# Altium schematic sheet Filters.SchDoc
size A4; SheetNumber: 4; SheetTotal: 4
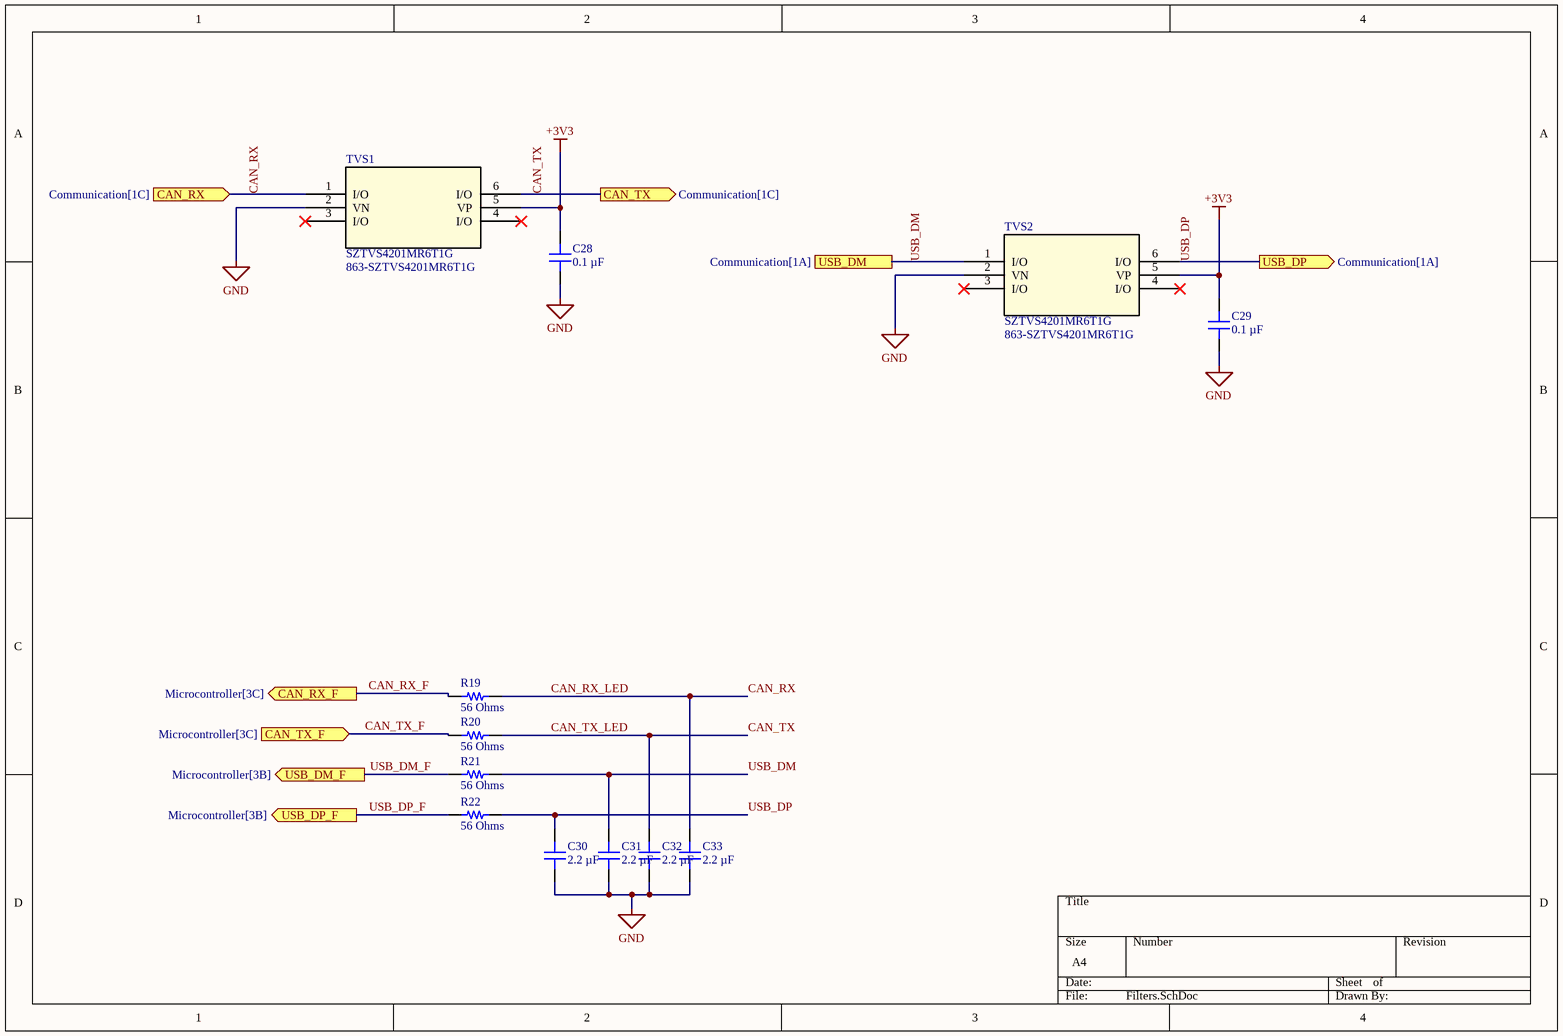
[diagram p0: Filters.SchDoc]

## Parts
C28  0.1 µF  [CAP 0805_2012]
C29  0.1 µF  [CAP 0805_2012]
C30  2.2 µF  [CAP 0805_2012]
C31  2.2 µF  [CAP 0805_2012]
C32  2.2 µF  [CAP 0805_2012]
C33  2.2 µF  [CAP 0805_2012]
R19  56 Ohms  [RES 0805_2012]
R20  56 Ohms  [RES 0805_2012]
R21  56 Ohms  [RES 0805_2012]
R22  56 Ohms  [RES 0805_2012]
TVS1  SZTVS4201MR6T1G  Supplier Part Number 1: 863-SZTVS4201MR6T1G  [SOP95P275X110-6N]
TVS2  SZTVS4201MR6T1G  Supplier Part Number 1: 863-SZTVS4201MR6T1G  [SOP95P275X110-6N]

## Ports
CAN_RX (in, see Communication[1C]), CAN_RX_F (out, see Microcontroller[3C]), CAN_TX (out, see Communication[1C]), CAN_TX_F (in, see Microcontroller[3C]), USB_DM (out, see Communication[1A]), USB_DM_F (out, see Microcontroller[3B]), USB_DP (out, see Communication[1A]), USB_DP_F (out, see Microcontroller[3B])

## Nets
+3V3: C28.2 C29.2 TVS1.5(VP) TVS2.5(VP)
GND: C28.1 C29.1 C30.1 C31.1 C32.1 C33.1 TVS1.2(VN) TVS2.2(VN)
CAN_RX: C33.2 R19.2 TVS1.1(I/O) ; port CAN_RX  [also labelled CAN_RX_LED]
CAN_RX_F: R19.1 ; port CAN_RX_F
CAN_TX: C32.2 R20.2 TVS1.6(I/O) ; port CAN_TX  [also labelled CAN_TX_LED]
CAN_TX_F: R20.1 ; port CAN_TX_F
USB_DM: C31.2 R21.2 TVS2.1(I/O) ; port USB_DM
USB_DM_F: R21.1 ; port USB_DM_F
USB_DP: C30.2 R22.2 TVS2.6(I/O) ; port USB_DP
USB_DP_F: R22.1 ; port USB_DP_F

Not connected (* = marked no-connect by the designer): TVS1 3(I/O)* 4(I/O)*; TVS2 3(I/O)* 4(I/O)*

## Library data of the parts
C28 C29 = CC0805MRX7R9BB104: CAP CER 0.1UF 50V X7R 0805; manufacturer: Yageo; Tolerance: ±20%; Part Number: CC0805MRX7R9BB104; Value: 0.1 µF; Applications: General Purpose; Capacitance: 0.1 µF; componentlink1description: Datasheet; componentlink1url: https://www.yageo.com/upload/media/product/productsearch/datasheet/mlcc/UPY-GPHC_X7R_6.3V-to-50V_18.pdf; componentlink2description: DigiKey Link; componentlink2url: https://www.digikey.com/en/products/detail/yageo/CC0805MRX7R9BB104/5884281; Device Package: 0805 (2012 Metric); lastupdated: 9.02.2024 20:16:09; Lifecycle Status: Active; Minimum Order: 1; Mounting Type: Surface Mount, MLCC; Operating Temperature: -55°C ~ 125°C; Package / Case: 0805 (2012 Metric); packaging: TapeAndReel; partid: 2475; Part Status: Active; price: 0.01; series: CC; Size / Dimension: 0.079" L x 0.049" W (2.00mm x 1.25mm); Supplier 1: DigiKey; Supplier Part Number 1: 311-4351-1-ND; Temperature Coefficient: X7R; Thickness (Max): 0.037" (0.95mm); Voltage - Rated: 50V
C30-C33 = TMK212B7225MG-TR: CAP CER 2.2UF 25V X7R 0805; manufacturer: Taiyo Yuden; Tolerance: ±20%; Part Number: TMK212B7225MG-TR; Value: 2.2 µF; Applications: SMPS Filtering; Capacitance: 2.2 µF; componentlink1description: Datasheet; componentlink1url: https://www.yuden.co.jp/productdata/catalog/mlcc01_e.pdf; componentlink2description: DigiKey Link; componentlink2url: https://www.digikey.com/en/products/detail/taiyo-yuden/TMK212B7225MG-TR/6563525; Device Package: 0805 (2012 Metric); lastupdated: 9.02.2024 20:16:05; Lifecycle Status: Active; Minimum Order: 1; Mounting Type: Surface Mount, MLCC; Operating Temperature: -55°C ~ 125°C; Package / Case: 0805 (2012 Metric); packaging: TapeAndReel; partid: 3807; Part Status: Active; price: 0.04; series: M; Size / Dimension: 0.079" L x 0.049" W (2.00mm x 1.25mm); Supplier 1: DigiKey; Supplier Part Number 1: 587-4932-1-ND; Temperature Coefficient: X7R; Thickness (Max): 0.053" (1.35mm); Voltage - Rated: 25V
R19-R22 = CPF0805B56RE1: RES SMD 56 OHM 0.1% 1/10W 0805; Manufacturer: TE Connectivity Passive Product; Power (Watts): 0.1W, 1/10W; Temperature Coefficient: ±25ppm/°C; Part Number: CPF0805B56RE1; Value: 56 Ohms; ComponentLink1Description: Datasheet; ComponentLink1URL: https://www.te.com/commerce/DocumentDelivery/DDEController?Action=srchrtrv&DocNm=1773200&DocType=DS&DocLang=English; ComponentLink2Description: DigiKey Link; ComponentLink2URL: https://www.digikey.com/en/products/detail/te-connectivity-passive-product/CPF0805B56RE1/2382003; Composition: Thin Film; Device Package: 0805 (2012 Metric); Height - Seated (Max): 0.026" (0.65mm); LastUpdated: 8.02.2024 21:02:01; Lifecycle Status: Active; Minimum Order: 1; Number of Terminations: 2; Operating Temperature: -55°C ~ 155°C; Package / Case: 0805 (2012 Metric); Packaging: TapeAndReel; PartId: 36553; Part Status: Active; Price: 0.12; Resistance: 56 Ohms; Series: CPF, Neohm; Size / Dimension: 0.079" L x 0.049" W (2.00mm x 1.25mm); Supplier 1: DigiKey; Supplier Part Number 1: A103223CT-ND; Supplier Device Package: 0805; Tolerance: ±0.1%
TVS1 TVS2 = SZTVS4201MR6T1G_1: Mfr_Name: onsemi; Copyright: Copyright (C) 2021 Ultra Librarian. All rights reserved.; Manufacturer_Part_Number: SZTVS4201MR6T1G; RefDes: RefDes; Type: DEV; Supplier 1: Mouser